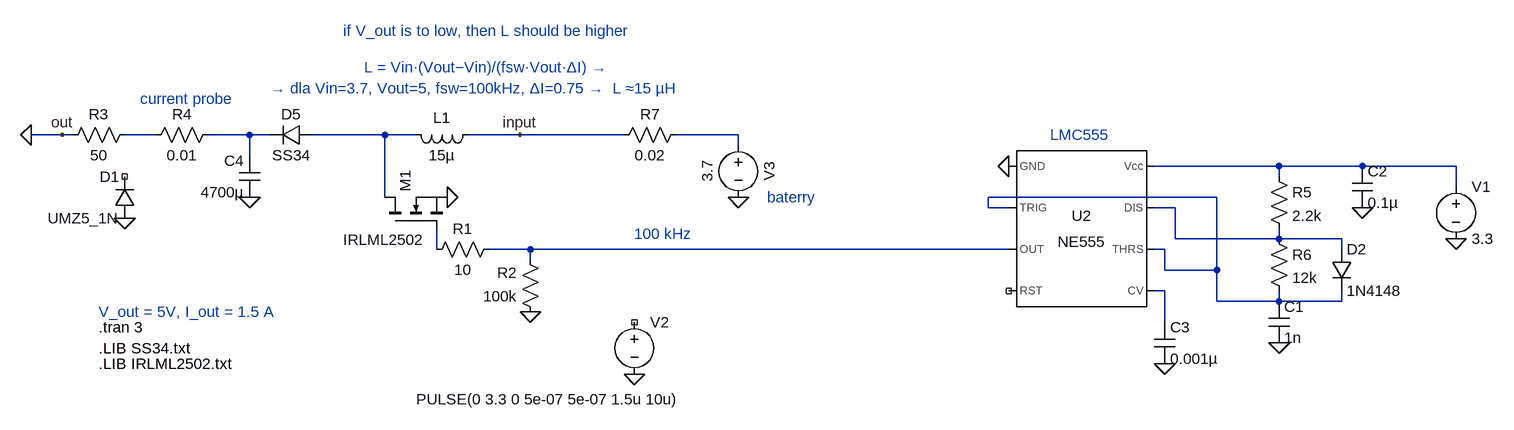
[diagram p0: schematic sym_pradnica.asc]
sym_pradnica.asc, the LTspice schematic file:
Version 4.1
SHEET 1 2740 1240
WIRE -320 512 -368 512
WIRE -304 512 -320 512
WIRE -176 512 -224 512
WIRE -32 512 -96 512
WIRE 0 512 -32 512
WIRE 176 512 64 512
WIRE 224 512 176 512
WIRE 384 512 304 512
WIRE 544 512 384 512
WIRE 720 512 624 512
WIRE 720 528 720 512
WIRE -32 544 -32 512
WIRE 1552 560 1360 560
WIRE 1680 560 1552 560
WIRE 1824 560 1680 560
WIRE 1552 576 1552 560
WIRE 1824 592 1824 560
WIRE 176 608 176 512
WIRE 1456 608 1104 608
WIRE 1104 624 1104 608
WIRE 1136 624 1104 624
WIRE 1392 624 1360 624
WIRE 1392 672 1392 624
WIRE 1552 672 1552 656
WIRE 1552 672 1392 672
WIRE 1648 672 1552 672
WIRE 256 688 256 656
WIRE 400 688 336 688
WIRE 1136 688 400 688
WIRE 1376 688 1360 688
WIRE 1648 688 1648 672
WIRE 400 704 400 688
WIRE 1376 720 1376 688
WIRE 1456 720 1456 608
WIRE 1456 720 1376 720
WIRE 1376 752 1360 752
WIRE 1456 768 1456 720
WIRE 1552 768 1552 752
WIRE 1552 768 1456 768
WIRE 1648 768 1648 752
WIRE 1648 768 1552 768
WIRE 1376 800 1376 752
FLAG 1136 560 0
FLAG 1552 832 0
FLAG 1824 672 0
FLAG 1680 624 0
FLAG 1376 864 0
FLAG -368 512 0
FLAG -32 608 0
FLAG 400 784 0
FLAG 384 512 input
FLAG 720 608 0
FLAG 560 880 0
FLAG 272 608 0
FLAG -224 640 0
FLAG -320 512 out
SYMBOL Misc\\NE555 1248 656 R0
SYMATTR InstName U2
SYMBOL cap 1536 768 R0
SYMATTR InstName C1
SYMATTR Value 1n
SYMBOL res 1536 560 R0
SYMATTR InstName R5
SYMATTR Value 2.2k
SYMBOL nmos 176 656 R270
WINDOW 3 -17 -64 VRight 2
SYMATTR Value IRLML2502
SYMATTR InstName M1
SYMBOL voltage 1824 576 R0
WINDOW 123 0 0 Left 0
WINDOW 39 0 0 Left 0
SYMATTR InstName V1
SYMATTR Value 3.3
SYMBOL cap 1664 560 R0
SYMATTR InstName C2
SYMATTR Value 0.1µ
SYMBOL res 1536 656 R0
SYMATTR InstName R6
SYMATTR Value 12k
SYMBOL cap 1360 800 R0
SYMATTR InstName C3
SYMATTR Value 0.001µ
SYMBOL ind 320 496 R90
WINDOW 0 5 56 VBottom 2
WINDOW 3 32 56 VTop 2
SYMATTR InstName L1
SYMATTR Value 15µ
SYMBOL diode 64 496 R90
WINDOW 0 0 32 VBottom 2
WINDOW 3 32 32 VTop 2
SYMATTR InstName D5
SYMATTR Value SS34
SYMBOL cap -16 608 R180
WINDOW 0 24 56 Left 2
WINDOW 3 24 8 Left 2
SYMATTR InstName C4
SYMATTR Value 4700µ
SYMBOL res 352 672 R90
WINDOW 0 0 56 VBottom 2
WINDOW 3 32 56 VTop 2
SYMATTR InstName R1
SYMATTR Value 10
SYMBOL res 416 800 R180
WINDOW 0 36 76 Left 2
WINDOW 3 36 40 Left 2
SYMATTR InstName R2
SYMATTR Value 100k
SYMBOL voltage 720 512 R0
WINDOW 0 32 56 VTop 2
WINDOW 3 -32 56 VBottom 2
WINDOW 123 0 0 Left 0
WINDOW 39 0 0 Left 0
SYMATTR InstName V3
SYMATTR Value 3.7
SYMBOL voltage 560 784 R0
WINDOW 123 0 0 Left 0
WINDOW 39 0 0 Left 0
WINDOW 3 -336 135 Left 2
SYMATTR Value PULSE(0 3.3 0 5e-07 5e-07 1.5u 10u)
SYMATTR InstName V2
SYMBOL diode -208 640 R180
WINDOW 0 24 64 Left 2
WINDOW 3 24 0 Left 2
SYMATTR InstName D1
SYMATTR Value UMZ5_1N
SYMBOL res -320 528 R270
WINDOW 0 32 56 VTop 2
WINDOW 3 0 56 VBottom 2
SYMATTR InstName R3
SYMATTR Value 50
SYMBOL res -80 496 R90
WINDOW 0 0 56 VBottom 2
WINDOW 3 32 56 VTop 2
SYMATTR InstName R4
SYMATTR Value 0.01
SYMBOL res 640 496 R90
WINDOW 0 0 56 VBottom 2
WINDOW 3 32 56 VTop 2
SYMATTR InstName R7
SYMATTR Value 0.02
SYMBOL diode 1632 688 R0
SYMATTR InstName D2
SYMATTR Value 1N4148
TEXT -264 808 Left 2 !.tran 3
TEXT 840 608 Right 2 ;baterry
TEXT -264 784 Left 2 ;V_out = 5V, I_out = 1.5 A
TEXT 144 408 Left 2 ;L = Vin·(Vout−Vin)/(fsw·Vout·ΔI) →
TEXT 0 440 Left 2 ;→ dla Vin=3.7, Vout=5, fsw=100kHz, ΔI=0.75 →  L ≈15 µH
TEXT -264 840 Left 2 !.LIB SS34.txt
TEXT -264 864 Left 2 !.LIB IRLML2502.txt
TEXT 560 664 Left 2 ;100 kHz
TEXT 1200 512 Left 2 ;LMC555
TEXT -200 456 Left 2 ;current probe
TEXT 112 352 Left 2 ;if V_out is to low, then L should be higher

The netlist it stands for:
* sym_pradnica.asc
X§U2 0 N006 N009 NC_01 N010 N006 N007 N005 NE555  ; pins GND TRIG OUT RST CV THRS DIS Vcc
C1 N006 0 1n
R5 N005 N007 2.2k
M1 N003 N008 0 0 IRLML2502
V1 N005 0 3.3
C2 N005 0 0.1µ
R6 N007 N006 12k
C3 N010 0 0.001µ
L1 input N003 15µ
D5 N003 N002 SS34
C4 0 N002 4700µ
R1 N009 N008 10
R2 0 N009 100k
V3 N004 0 3.7
V2 NC_02 0 PULSE(0 3.3 0 5e-07 5e-07 1.5u 10u)
D1 0 NC_03 UMZ5_1N
R3 0 N001 50
R4 N002 N001 0.01
R7 N004 input 0.02
D2 N007 N006 1N4148
.model D D
.lib standard.dio
.model NMOS NMOS
.model PMOS PMOS
.lib standard.mos
.tran 3
* baterry
* V_out = 5V, I_out = 1.5 A
* L = Vin·(Vout−Vin)/(fsw·Vout·ΔI) →
* → dla Vin=3.7, Vout=5, fsw=100kHz, ΔI=0.75 →  L ≈15 µH
.LIB SS34.txt
.LIB IRLML2502.txt
* 100 kHz
* LMC555
* current probe
* if V_out is to low, then L should be higher
.lib NE555.sub
.backanno
.end